# EasyEDA Pro project SmartHome-Voice-Assit.epro, board ESP-SPOT-SUB
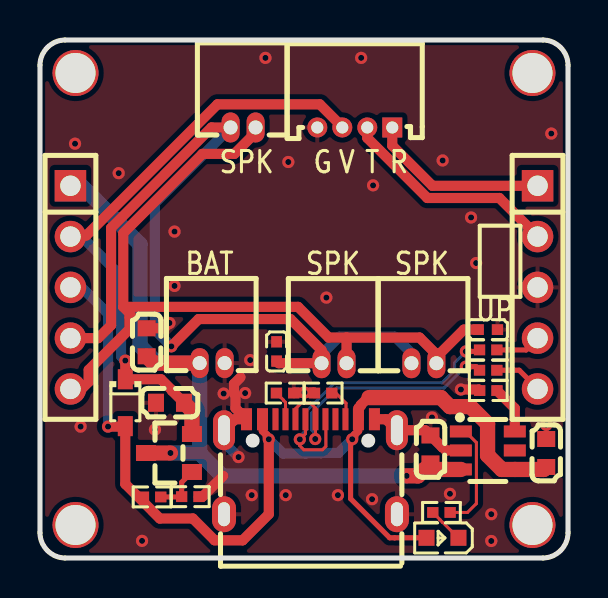
[diagram p5: board, top side]
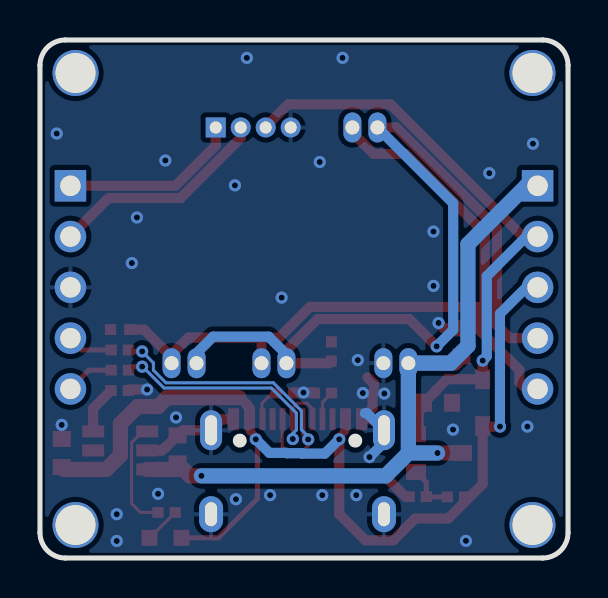
[diagram p6: board, bottom side, seen from below]

Outline 26.42 x 25.91 mm; copper layers: Top Layer, Bottom Layer. Coordinates in mm from the lower left corner of the outline.
Outline path: 0,24.64 0,1.27 arc(0.37,0.37) 1.27,0 25.15,0 arc(26.04,0.37) 26.42,1.27 26.42,24.64 arc(26.04,25.54) 25.15,25.91 1.27,25.91 arc(0.37,25.54) 0,24.64
Stack: Top Layer 0.035mm / Dielectric1 1.51mm FR4 er 4.5 / Bottom Layer 0.035mm

## Design rules (mm)
template: JLCPCB Capability(Two Layers Board)
spacing copperThickness1oz (default): track to track 0.102, other pairs 0.152 to 0.3
spacing copperThickness2oz: track to track 0.203, other pairs 0.152 to 0.3
track width copperThickness1oz (default): min 0.127, default 0.254, max 2.54
track width copperThickness2oz: min 0.203, default 0.254, max 2.54
differential pair differentialPair (default): width min 0.127, default 0.254, max 2.54; gap min 0.152, default 0.152
via viaSize (default): diameter min 0.5, default 0.61, max 10; hole min 0.3, default 0.305, max 6.3

## Placement (name value [footprint] x y rotation side)
C6  10uF  [C0603]  6.5 7.77 0 top
C8  10uF  [C0603]  5.34 10.79 270 top
C12  10uF  [C0603]  19.53 5.43 270 top
C13  10uF  [C0603]  25.32 5.25 270 top
C34  1nF  [C0402]  11.84 10.33 270 top
C35  1nF  [C0402]  22.41 11.42 180 top
CN1  HC-1.25-4AW  [CONN-TH_4P-P1.25_HCTL_HC-1.25-4AW]  15.75 21.53 180 top
D1  1N5819WS  [SOD-323_L1.8-W1.3-LS2.5-RD]  4.27 7.77 270 top
H3  2.54-1*5P母  [HDR-TH_5P-P2.54-V-F]  1.52 13.54 270 top
H4  2.54-1*5P母  [HDR-TH_5P-P2.54-V-F]  24.89 13.54 270 top
LED1  KT-0603R  [LED0603-RD]  20.14 1.01 180 top
NOREF  -  [Pad_e271]  24.64 1.65 90 top
NOREF#2  -  [Pad_e273]  1.78 24.26 0 top
NOREF#3  -  [Pad_e274]  24.64 24.26 0 top
NOREF#4  -  [Pad_e272]  1.78 1.65 90 top
Q1  AO3401A  [SOT-23_L2.9-W1.3-P1.90-LS2.4-BR]  6.45 5.25 0 top
R3  2kΩ  [R0402]  5.61 3.06 180 top
R5  20kΩ  [R0402]  7.52 3.07 180 top
R7  0Ω  [R0402]  22.42 10.41 180 top
R8  0Ω  [R0402]  22.42 9.39 180 top
R9  5.1kΩ  [R0402]  14.17 8.25 180 top
R11  5.1kΩ  [R0402]  12.26 8.25 0 top
R13  1kΩ  [R0402]  20.08 2.28 180 top
R14  5.1kΩ  [R0402]  22.43 8.38 0 top
U3  TP4057  [SOT-23-6_L2.9-W1.6-P0.95-LS2.8-BR]  22.4 5.38 180 top
U9  ZX-MX1.25-2PWZ  [CONN-TH_2P-P1.25_ZX-MX1.25-2PWZ]  8.61 9.75 180 top
U11  ZX-MX1.25-2PWZ  [CONN-TH_2P-P1.25_ZX-MX1.25-2PWZ]  10.16 21.53 180 top
U16  ZX-MX1.25-2PWZ  [CONN-TH_2P-P1.25_ZX-MX1.25-2PWZ]  19.21 9.74 180 top
U17  ZX-MX1.25-2PWZ  [CONN-TH_2P-P1.25_ZX-MX1.25-2PWZ]  14.71 9.74 180 top
USB1  TYPE-C 16PIN 2MD(073)  [USB-C-SMD_TYPE-C-6PIN-2MD-073]  13.53 4.57 0 top

## Footprints (pads in the part's own frame, mm; a bottom-side part is the same pattern mirrored in y, then rotated)
C0402
  rect 0.566x0.54 smd: 1(-0.481,0) 2(0.481,0)
C0603
  rect 0.8x0.9 smd: 1(-0.7,0) 2(0.7,0)
CONN-TH_2P-P1.25_ZX-MX1.25-2PWZ
  oval 0.9x1.5 hole 0.7: 1(-0.625,0) 2(0.625,0)
CONN-TH_4P-P1.25_HCTL_HC-1.25-4AW
  rect 1x1 hole 0.6: 1(-1.875,0)
  round 1 hole 0.6: 2(-0.625,0) 3(0.625,0) 4(1.875,0)
HDR-TH_5P-P2.54-V-F
  rect 1.575x1.575 hole 1.02: 1(-5.08,0)
  round 1.575 hole 1.02: 2(-2.54,0) 3(0,0) 4(2.54,0) 5(5.08,0)
LED0603-RD
  rect 0.8x0.8 smd: 1(-0.799,0) 2(0.799,0)
Pad_e271
  round 2.3 hole 2: 1(0,0)
Pad_e272
  round 2.3 hole 2: 1(0,0)
Pad_e273
  round 2.3 hole 2: 1(0,0)
Pad_e274
  round 2.3 hole 2: 2(0,0)
R0402
  rect 0.566x0.54 smd: 1(-0.433,0) 2(0.433,0)
SOD-323_L1.8-W1.3-LS2.5-RD
  rect 1x0.75 smd: 1(-1.173,0) 2(1.173,0)
SOT-23-6_L2.9-W1.6-P0.95-LS2.8-BR
  rect 1.1x0.6 smd: 1(1.35,-0.95) 2(1.35,0) 3(1.35,0.95) 4(-1.35,0.95) 5(-1.35,0) 6(-1.35,-0.95)
SOT-23_L2.9-W1.3-P1.90-LS2.4-BR
  rect 1x0.8 smd: 1(1.15,-0.95) 2(1.15,0.95) 3(-1.15,0)
USB-C-SMD_TYPE-C-6PIN-2MD-073
  rect 0.55x1.1 smd: 1(-3.2,2.375) 2(-2.4,2.375) 11(2.4,2.375) 12(3.2,2.375)
  rect 0.3x1.1 smd: 3(-1.75,2.375) 4(-1.25,2.375) 5(-0.75,2.375) 6(-0.25,2.375) 7(0.25,2.375) 8(0.75,2.375) 9(1.25,2.375) 10(1.75,2.375)
  oval 1.1x2 hole 0.6x1.5: 13(-4.325,1.825) 14(4.325,1.825)
  oval 1.2x1.8 hole 0.6x1.2: 13(-4.325,-2.375) 14(4.325,-2.375)

## Nets
As in the schematic.

Pads without a net: NOREF 1; NOREF#2 1; NOREF#3 2; NOREF#4 1; U3 5; USB1 3 9

## Via types
v1: diameter 0.61, hole 0.305, Top Layer to Bottom Layer, 43 vias

## Routing (per net, layer and track width the routed paths; a pad name or vN(x,y) marks a point on that pad's centre or on a via; arc(x,y) is an arc through that point)
GND: length 16.7
  Top Layer w0.508: USB1.12 17.31,6.94 USB1.14 19.27,6.39 C12.1 20.13,5.54 20.15,5.54 20.31,5.38 U3.2 ; R5.1 8.13,3.07 9.17,4.11 ; v1(6.48,11.75) 6.21,11.49 C8.1 ; USB1.13 9.76,6.94 USB1.1 9.78,7.49 9.78,8.15 9.71,8.22 9.71,8.71 10.03,9.04 ; R9.2 13.71,8.27 v1(13.23,8.27) 12.72,8.27 R11.2 ; v1(21.06,8.43) 21.95,8.43 R14.1
  Bottom Layer w0.508: v1(9.93,5.05) 9.21,5.77 USB1.13 10.06,7.24 10.16,7.24
  vias: v1(1.75,20.72) v1(2.03,6.57) v1(3.94,19.25) v1(5.11,0.86) v1(5.75,6.42) v1(6.73,16.33) v1(6.73,13.61) v1(9.19,8.22) v1(10.26,8.25) v1(10.52,9.9) v1(10.59,3.14) v1(11.28,25.01) v1(12.29,3.14) v1(12.42,19.81) v1(14.33,13.02) v1(14.9,3.14) v1(16.07,25.01) v1(16.61,2.94) v1(16.66,18.64) v1(19.61,7.03) v1(20.14,19.88) v1(20.51,3.21) v1(21.57,17.03) v1(21.82,14.75) v1(22.58,2.19) v1(22.58,0.85) v1(25.33,6.66) v1(25.58,21.23)
VBAT_1: length 36.8
  Top Layer w0.762: 5.34,10.09 5.68,9.75 U9.2 ; Q1.3 v1(6.53,5.25) ; v1(18.34,4.11) 18.91,4.11 19.23,4.43 U3.3
  Bottom Layer w0.762: H3.1 2.08,18.62 5.01,15.7 5.01,10.61 5.87,9.75 U9.2 7.99,5.25 ; 7.99,5.25 v1(6.53,5.25) ; 7.99,5.25 7.99,5.24 9.12,4.11 v1(18.34,4.11)
VBUS_1: length 51.8
  Top Layer w0.254: LED1.2 17.75,1.01 17.75,1.01 17.49,1.01 15.54,2.97 15.54,5.86 v1(15.62,5.94)
  Top Layer w0.381: USB1.2 11.13,6.36 11.34,6.16 11.34,6.05 v1(11.45,5.94) ; v1(15.62,5.94) 15.73,6.05 15.73,6.16 15.93,6.36 USB1.11
  Top Layer w0.508: v1(11.45,5.94) 11.45,2.19 10.14,0.88 8.74,0.88 7.65,1.97 6,1.97 4.27,3.7 D1.2 4.25,6.57 v1(3.41,6.57) ; 16.46,8.02 16.33,7.9 16.29,7.9 16.05,7.66 16.05,7.61 15.93,7.5 USB1.11
  Top Layer w0.762: C13.2 25.2,4.43 U3.4 23.1,4.43 22.39,5.14 22.39,6.71 21.53,7.57 20.51,7.57 20.06,8.02 16.46,8.02
  Bottom Layer w0.508: H3.3 2.08,13.54 3.41,12.22 v1(3.41,6.57) ; v1(11.45,5.94) 12.16,5.22 13.29,5.22 13.31,5.24 14.06,5.24 14.08,5.26 14.94,5.26 v1(15.62,5.94)
VIN_1: length 30.6
  Top Layer w0.508: H3.2 1.58,16.13 2.32,16.13 8.88,22.69 14,22.69 15.12,21.56 CN1.3 ; v1(4.27,9.87) D1.1 6.06,8.94 6.61,8.38 6.61,8.36 C6.2
  Top Layer w0.762: C6.2 7.6,7.37 Q1.2
  Bottom Layer w0.508: v1(4.27,9.87) 4.06,10.08 4.06,14.1 2.08,16.08 H3.2
CONN1_1: length 9
  Top Layer w0.508: CN1.1 17.62,20.62 19.63,18.62 24.91,18.62
CONN2_1: length 11.1
  Top Layer w0.508: CN1.2 16.37,21.01 19.38,18.01 22.98,18.01 24.91,16.08
USB_DN: length 14.1
  Top Layer w0.152: USB1.5 12.78,7.46 13.06,7.74 13.53,7.74 13.79,7.49 13.79,6.94 USB1.7 13.78,5.96 v1(13.77,5.95)
  Top Layer w0.254: 21.99,9.39 21.81,9.57 v1(21.3,9.57)
  Bottom Layer w0.152: v1(13.77,5.95) 13.77,6.22 13.59,6.4 13.59,7.25 14.84,8.5 20.21,8.5 21.28,9.57 v1(21.3,9.57)
USB_DN_1: length 2.4
  Top Layer w0.254: R8.1 23.97,9.39 24.91,8.46
USB_DP: length 16
  Top Layer w0.152: USB1.8 14.3,6.92 14.3,5.58 14.13,5.41 13.2,5.41 12.98,5.63 12.98,5.91 v1(13,5.93) 13.28,6.22 USB1.6
  Top Layer w0.254: 21.99,10.41 21.91,10.33 v1(21.31,10.33)
  Bottom Layer w0.152: v1(21.31,10.33) 21.31,10.32 20.74,9.76 20.74,9.39 20.11,8.76 14.74,8.76 13.34,7.36 13.34,6.42 13,6.08 v1(13,5.93)
USB_DP_1: length 2.3
  Top Layer w0.254: R7.1 24.32,10.41 24.91,11
VON_1: length 39.5
  Top Layer w0.508: U11.1 10.79,21.27 9.73,20.21 8.13,20.21 4.17,16.25 4.17,12.56 ; 4.17,12.56 4.52,12.21 4.52,12.1 4.48,12.06 4.48,11.45 2.44,9.41 2.44,8.81 2.08,8.46 H3.5 ; 4.17,12.56 12.91,12.56 14.45,11.02 15.34,11.02 ; 19.83,10.05 21.21,11.42 C35.2 ; 19.83,10.05 19.83,10.18 18.99,11.02 15.34,11.02 ; 19.83,10.05 U16.1 ; 15.34,11.02 U17.1
VOP_1: length 45.9
  Top Layer w0.508: C34.2 11.94,9.74 14.09,9.74 14.09,10.39 12.53,11.95 7.94,11.95 v1(6.57,10.59) ; H3.4 2.91,11 3.56,11.64 3.56,16.51 8.58,21.53 U11.2
  Bottom Layer w0.508: v1(6.57,10.59) 5.74,11.42 5.74,17.74 U11.2 ; U16.2 18.58,10.25 17.76,11.07 14.97,11.07 14.09,10.18 14.09,9.74
$1N1534: length 5.6
  Top Layer w0.152: U3.1 21.28,6.33 21.83,5.77 21.83,2.72 21.39,2.28 20.52,2.28
$1N1535: length 1.8
  Top Layer w0.152: LED1.1 20.92,1.01 20.15,1.78 20.14,1.78 20.01,1.91 20.01,1.92 R13.2
$1N1542: length 2.4
  Top Layer w0.508: R14.2 23.75,7.48 U3.6
$1N1544: length 1.5
  Top Layer w0.152: USB1.4 12.28,7.79 12.18,7.88 12.18,7.89 11.83,8.25
$1N1545: length 1.7
  Top Layer w0.152: USB1.10 15.31,6.97 15.31,7.74 14.8,8.25 R9.1
$1N1550: length 2.5
  Top Layer w0.254: Q1.1 7.09,3.79 7.09,3.07 7.07,3.06 R3.1

## Copper pours and planes (outline as drawn; the poured copper is in the pictures)
GND on Top Layer: -10.54,36.07 28.83,36.07 28.83,-2.29 -10.54,-2.29
GND on Bottom Layer: -5.08,32.51 32,32.51 32,-5.08 -5.08,-5.08

## Text on the board
Top Silkscreen Layer: BAT | SPK | UP | G | V | T | R | ⬆
